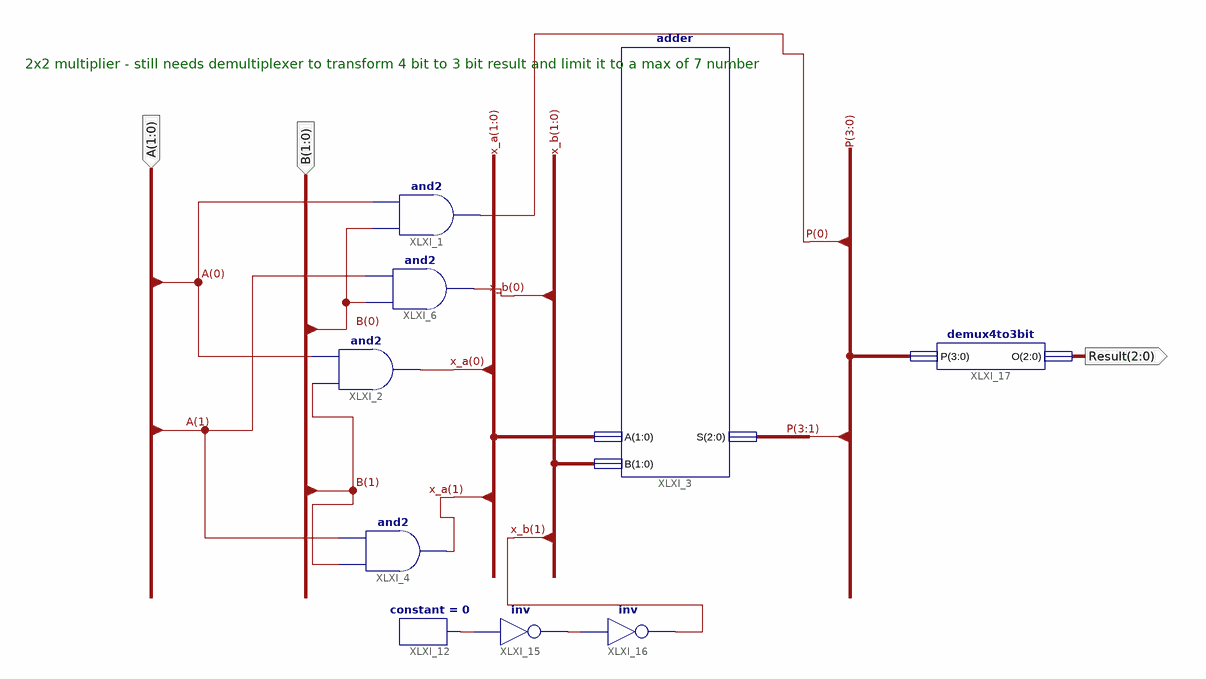
[diagram p0: schematic sheet 1]
// Xilinx ISE schematic multiplier.sch (spartan3e) as structural Verilog: 9 symbols, 3 ports
module multiplier (
  input  [1:0] A,
  input  [1:0] B,
  output [2:0] Result
);

  wire XLXN_71, XLXN_72;
  wire [1:0] x_a, x_b;
  wire [3:0] P;

  and XLXI_1 (P[0], B[0], A[0]);
  and XLXI_2 (x_a[0], B[1], A[0]);
  adder XLXI_3 (.B(x_b), .A(x_a), .S(P[3:1]));
  and XLXI_6 (x_b[0], B[0], A[1]);
  and XLXI_4 (x_a[1], B[1], A[1]);
  constant #(.CValue("0")) XLXI_12 (.O(XLXN_71));
  not XLXI_15 (XLXN_72, XLXN_71);
  not XLXI_16 (x_b[1], XLXN_72);
  demux4to3bit XLXI_17 (.P(P), .O(Result));

  // Notes on the sheet:
  //   2x2 multiplier - still needs demultiplexer to transform 4 bit to 3 bit result and limit it to a max of 7 number
endmodule
